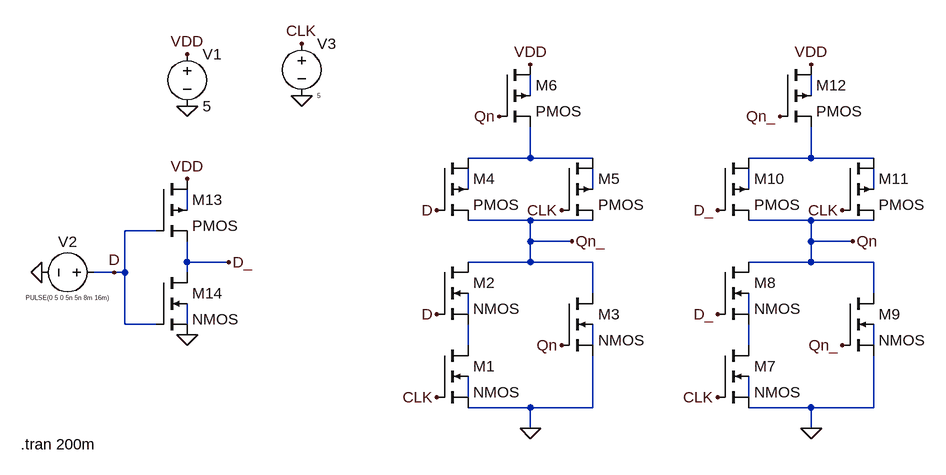
[diagram p0: schematic CMOS_DFLIP.asc]
CMOS_DFLIP.asc, the LTspice schematic file:
Version 4
SHEET 1 880 680
WIRE 192 -208 192 -240
WIRE 624 -208 624 -240
WIRE 192 -112 192 -160
WIRE 192 -112 96 -112
WIRE 288 -112 192 -112
WIRE 624 -112 624 -160
WIRE 624 -112 528 -112
WIRE 720 -112 624 -112
WIRE 96 -64 96 -96
WIRE 288 -64 288 -96
WIRE 528 -64 528 -96
WIRE 720 -64 720 -96
WIRE -336 -32 -336 -64
WIRE 192 -16 96 -16
WIRE 288 -16 192 -16
WIRE 624 -16 528 -16
WIRE 720 -16 624 -16
WIRE -384 0 -432 0
WIRE 192 16 192 -16
WIRE 256 16 192 16
WIRE 624 16 624 -16
WIRE 688 16 624 16
WIRE -336 48 -336 16
WIRE -272 48 -336 48
WIRE 192 48 192 16
WIRE 192 48 96 48
WIRE 288 48 192 48
WIRE 624 48 624 16
WIRE 624 48 528 48
WIRE 720 48 624 48
WIRE -448 64 -480 64
WIRE -432 64 -432 0
WIRE -432 64 -448 64
WIRE -336 64 -336 48
WIRE 288 96 288 48
WIRE 720 96 720 48
WIRE 96 128 96 96
WIRE 528 128 528 96
WIRE -432 144 -432 64
WIRE -384 144 -432 144
WIRE -336 144 -336 112
WIRE 96 176 96 144
WIRE 288 176 288 144
WIRE 528 176 528 144
WIRE 720 176 720 144
WIRE 96 256 96 224
WIRE 528 256 528 224
WIRE 192 272 96 272
WIRE 288 272 288 192
WIRE 288 272 192 272
WIRE 624 272 528 272
WIRE 720 272 720 192
WIRE 720 272 624 272
WIRE 192 304 192 272
WIRE 624 304 624 272
FLAG 48 128 D
FLAG 48 256 CLK
FLAG 240 176 Qn
FLAG 192 304 0
FLAG 48 -32 D
FLAG 240 -32 CLK
FLAG 144 -176 Qn
FLAG 192 -256 VDD
FLAG 256 16 Qn_
FLAG 480 128 D_
FLAG 480 256 CLK
FLAG 672 176 Qn_
FLAG 624 304 0
FLAG 480 -32 D_
FLAG 672 -32 CLK
FLAG 576 -176 Qn_
FLAG 624 -256 VDD
FLAG 688 16 Qn
FLAG -336 -192 0
FLAG -336 -272 VDD
FLAG -336 160 0
FLAG -560 64 0
FLAG -448 64 D
FLAG -272 48 D_
FLAG -336 -80 VDD
FLAG -160 -288 CLK
FLAG -160 -208 0
SYMBOL nmos4 48 176 R0
SYMATTR InstName M1
SYMBOL nmos4 48 48 R0
SYMATTR InstName M2
SYMBOL nmos4 240 96 R0
SYMATTR InstName M3
SYMBOL pmos4 48 -112 R0
SYMATTR InstName M4
SYMBOL pmos4 240 -112 R0
SYMATTR InstName M5
SYMBOL pmos4 144 -256 R0
SYMATTR InstName M6
SYMBOL nmos4 480 176 R0
SYMATTR InstName M7
SYMBOL nmos4 480 48 R0
SYMATTR InstName M8
SYMBOL nmos4 672 96 R0
SYMATTR InstName M9
SYMBOL pmos4 480 -112 R0
SYMATTR InstName M10
SYMBOL pmos4 672 -112 R0
SYMATTR InstName M11
SYMBOL pmos4 576 -256 R0
SYMATTR InstName M12
SYMBOL voltage -336 -288 R0
WINDOW 123 0 0 Left 0
WINDOW 39 0 0 Left 0
SYMATTR InstName V1
SYMATTR Value 5
SYMBOL pmos4 -384 -80 R0
SYMATTR InstName M13
SYMBOL nmos4 -384 64 R0
SYMATTR InstName M14
SYMBOL voltage -464 64 R90
WINDOW 0 -32 56 VBottom 2
WINDOW 3 32 56 VTop 0
WINDOW 123 0 0 Left 0
WINDOW 39 0 0 Left 0
SYMATTR InstName V2
SYMATTR Value PULSE(0 5 0 5n 5n 8m 16m)
SYMBOL voltage -160 -304 R0
WINDOW 3 24 96 Left 0
WINDOW 123 0 0 Left 0
WINDOW 39 0 0 Left 0
SYMATTR InstName V3
SYMATTR Value 5
TEXT -592 328 Left 2 !.tran 200m

The netlist it stands for:
* CMOS_DFLIP.asc
M1 N013 CLK 0 N017 NMOS
M2 Qn_ D N013 N010 NMOS
M3 Qn_ Qn 0 N014 NMOS
M4 N003 D Qn_ N005 PMOS
M5 N003 CLK Qn_ N006 PMOS
M6 VDD Qn N003 N001 PMOS
M7 N015 CLK 0 N018 NMOS
M8 Qn D_ N015 N011 NMOS
M9 Qn Qn_ 0 N016 NMOS
M10 N004 D_ Qn N007 PMOS
M11 N004 CLK Qn N008 PMOS
M12 VDD Qn_ N004 N002 PMOS
V1 VDD 0 5
M13 VDD D D_ N009 PMOS
M14 D_ D 0 N012 NMOS
V2 D 0 PULSE(0 5 0 5n 5n 8m 16m)
V3 CLK 0 5
.model NMOS NMOS
.model PMOS PMOS
.lib standard.mos
.tran 200m
.backanno
.end